# EAGLE schematic transmitter_SI5351_Arduinol (EAGLE 9.6.2)
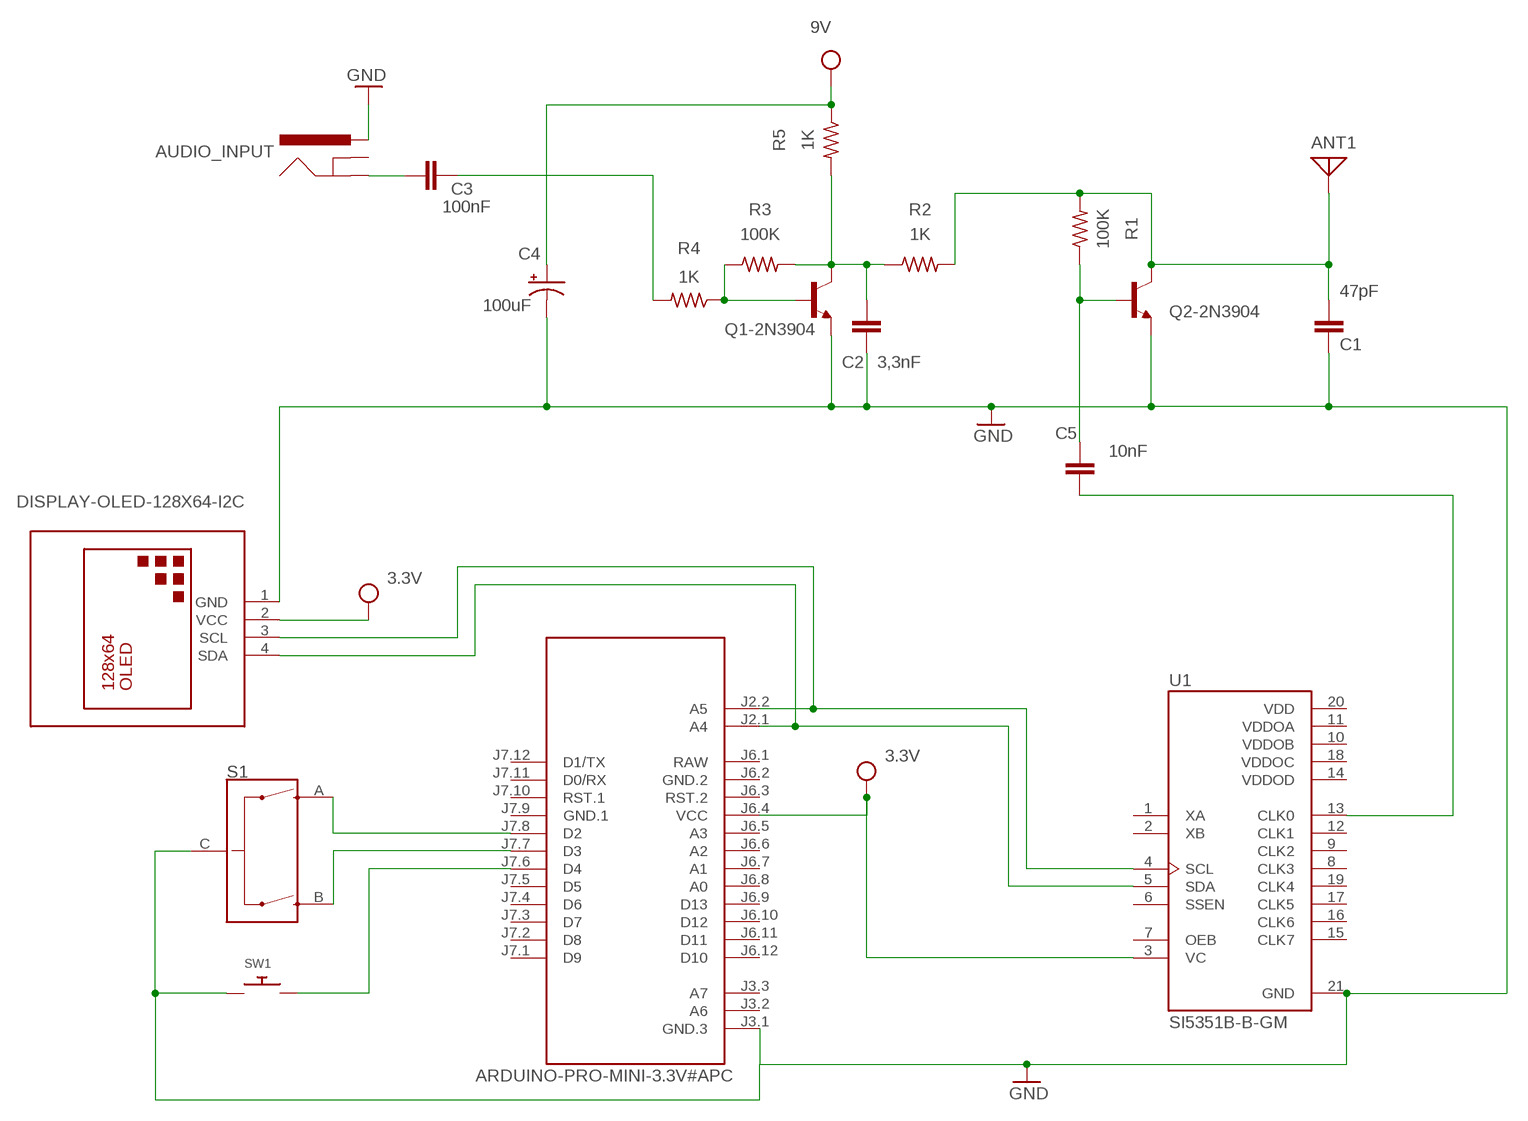
[diagram p0: schematic, sheet 1]

## Parts
ANT1  ANTENNA  [PAD-01]
AUDIO_INPUT  POWER_JACKPTH_SMD_COMBO  [POWER_JACK_COMBO]
C1  47pF  CXXC10B6  [XC10B6]
C2  3,3nF  CXXC10B6  [XC10B6]
C3  100nF  CXXC10B6  [XC10B6]
C4  100uF  100UF-POLAR-10X10.5-63V-20%  [NIC_10X10.5_CAP]
C5  10nF  CXXC10B6  [XC10B6]
M2  ARDUINO-PRO-MINI-3.3V#APC  [ARDUINO-PRO-MINI#APC]
Q1-2N3904  200mA/40V  TRANS_NPN-2N3904  [TO-92]
Q2-2N3904  200mA/40V  TRANS_NPN-2N3904  [TO-92]
R1  100K  R-US_AXIAL-7.2MM-PITCH  [RESAD724W46L381D178B]
R2  1K  R-US_AXIAL-7.2MM-PITCH  [RESAD724W46L381D178B]
R3  100K  R-US_AXIAL-7.2MM-PITCH  [RESAD724W46L381D178B]
R4  1K  R-US_AXIAL-7.2MM-PITCH  [RESAD724W46L381D178B]
R5  1K  R-US_AXIAL-7.2MM-PITCH  [RESAD724W46L381D178B]
S1  ENCODER  [ENCODER-16MM-QUAD]
SW1  SWITCH_PUSHBUTTONC&K_KSS  [BTN_CK_KSS]
U1  SI5351B-B-GM  [QFN50P400X400X90-21N]
U$2  DISPLAY-OLED-128X64-I2C  [DISPLAY-OLED-128X64-I2C]

## Nets
GND: AUDIO_INPUT.POWER(PWR) C1.2 C2.2 C4.- M2.J3.1(GND.3) Q1-2N3904.1(E) Q2-2N3904.1(E) S1.C SW1.P$1 U1.21(GND) U$2.1(GND)
N$1: AUDIO_INPUT.GND@1(GND) C3.1
N$2: C5.1 Q2-2N3904.2(B) R1.1
N$3: ANT1.1 C1.1 Q2-2N3904.3(C) R1.2 R2.2
N$4: C2.1 Q1-2N3904.3(C) R2.1 R3.2 R5.2
N$5: Q1-2N3904.2(B) R3.1 R4.1
N$6: C3.2 R4.2
N$7: M2.J2.1(A4) U1.5(SDA) U$2.4(SDA)
N$8: M2.J2.2(A5) U1.4(SCL) U$2.3(SCL)
N$9: C5.2 U1.13(CLK0)
N$10: M2.J7.8(D2) S1.A
N$11: M2.J7.7(D3) S1.B
N$12: M2.J7.6(D4) SW1.P$2
VCC: C4.+ M2.J6.4(VCC) R5.1 U1.3(VC) U$2.2(VCC)
Unconnected: AUDIO_INPUT.GND(GNDBREAK) M2.J3.2(A6) M2.J3.3(A7) M2.J6.3(RST.2) M2.J6.5(A3) M2.J6.6(A2) M2.J6.7(A1) M2.J6.8(A0) M2.J6.9(D13) M2.J6.10(D12) M2.J6.11(D11) M2.J6.12(D10) M2.J7.1(D9) M2.J7.2(D8) M2.J7.3(D7) M2.J7.4(D6) M2.J7.5(D5) M2.J7.10(RST.1) M2.J7.11(D0/RX) M2.J7.12(D1/TX) U1.1(XA) U1.2(XB) U1.6(SSEN) U1.7(OEB) U1.8(CLK3) U1.9(CLK2) U1.12(CLK1) U1.15(CLK7) U1.16(CLK6) U1.17(CLK5) U1.19(CLK4)

## Power pins joined to a net without a drawn wire
GND.1: M2.J7.9(GND.1)
GND.2: M2.J6.2(GND.2)
RAW: M2.J6.1(RAW)
VDD: U1.20(VDD)
VDDOA: U1.11(VDDOA)
VDDOB: U1.10(VDDOB)
VDDOC: U1.18(VDDOC)
VDDOD: U1.14(VDDOD)

## Library data of the parts
ANT1 = discrete:ANTENNA: Antenna
AUDIO_INPUT = SparkFun-Connectors:POWER_JACK: Power Jack Connector This is the standard 5.5mm barrel jack for power. The PTH is the most common, proven, reliable, footprint. The Slot footprint only works if the mill layer is transmitted to the PCB fab house so be warned. Here are the connectors we sell at SparkFun: DC Barrel Power Jack/Connector <https://www.sparkfun.com/products/119> (PRT-00119) DC Barrel Power Jack/Connector (SMD) <https://www.sparkfun.com/products/12748> (PRT-12748) DC Barrel Jack Adapter - Breadboard Compatible <https://www.sparkfun.com/products/10811> (PRT-10811) It is used on this SparkFun product (and many, many others): SparkFun RedBoard - Programmed with Arduino <https://www.sparkfun.com/products/12757> (DEV-12757) Also, if you need a mating power supply or connector, please check these out: Wall Adapter Power Supply - 9VDC 650mA <https://www.sparkfun.com/products/298> (TOL-00298) DC Barrel Jack Adapter - Male <https://www.sparkfun.com/products/10287> (PRT-10287)
C1-C3 C5 = rcl:CX: X CAPACITOR for power line; SPICEPREFIX: C
C4 = SparkFun-Capacitors:100UF-POLAR: 100µF polarized capacitors A capacitor is a passive two-terminal electrical component used to store electrical energy temporarily in an electric field.; PROD_ID: CAP-08362
M2 = diy-modules:ARDUINO-PRO-MINI-*#APC: Arduino Pro Mini (and compatible devices) with angle programming connector More details available here: https://www.arduino.cc/en/Main/ArduinoBoardProMini Click here to find device on ebay.com <http://www.ebay.com/sch/arduino+pro+mini>
Q1-2N3904 Q2-2N3904 = SparkFun-DiscreteSemi:TRANS_NPN: NPN transistor Current controlled devices typically used to amplify current or used as a switch. BC547 - COM-08928 <http://www.sparkfun.com/products/8928> (TO-92 45V 100mA) (1.Collector 2.Base 3.Emitter) 2N3904 - COM-00521 <http://www.sparkfun.com/products/521> (TO-92 40V 200mA) (1.Emitter 2.Base 3.Collector) P2N2222A - COM-12852 <http://www.sparkfun.com/products/12852> (TO-92 40V 600mA) (1.Collector 2.Base 3.Emitter); PROD_ID: TRANS-08447
R1-R5 = Resistor:R-US: Resistor Fixed - ANSI; CATEGORY: Resistor; SUB-CATEGORY: Fixed
S1 = SparkFun-Switches:ENCODER: Rotary Encoder Encoders rotate similarly to potentiometers, but they’re different from potentiometers in that an encoder has full rotation without limits. They output gray code so that you can tell how much and in which direction the encoder has been turned. SparkFun Products Used on the https://www.sparkfun.com/products/11043 (COM-11043); PROD_ID: RES-11299
SW1 = adafruit:SWITCH_PUSHBUTTON: Buttons SOFTTOUCHSMD_SJ - Soft touch temporary push button (Super Junk Akihabara) Compatible with SKPMANE010 [Mouser: 688-SKPMAN] C&K_KSS = Digikey: KSS221GLFS
U1 = SI5351B-B-GM:SI5351B-B-GM: Programmable PLL Clock Generator Single 0.0025MHz to 200MHz 20-Pin QFN Bulk; AVAILABILITY: Unavailable; DESCRIPTION: IC CLK GENERATOR 200MHZ 20QFN; MF: Silicon Labs; MP: SI5351B-B-GM; PACKAGE: QFN-20 Silicon Labs; PRICE: None
U$2 = diy-modules:DISPLAY-OLED-128X64-I2C: 128x64 Dot Matrix OLED Module based on SSD1306 chip Variant with I2C interface More details available here: http://www.instructables.com/id/Monochrome-096-i2c-OLED-display-with-arduino-SSD13/ SSD1306 datasheet: https://cdn-shop.adafruit.com/datasheets/SSD1306.pdf Click here to find device on ebay.com <http://www.ebay.com/sch/oled+display+128x64+iic> Note: There are two variants: I2C and SPI. Search for the proper version.